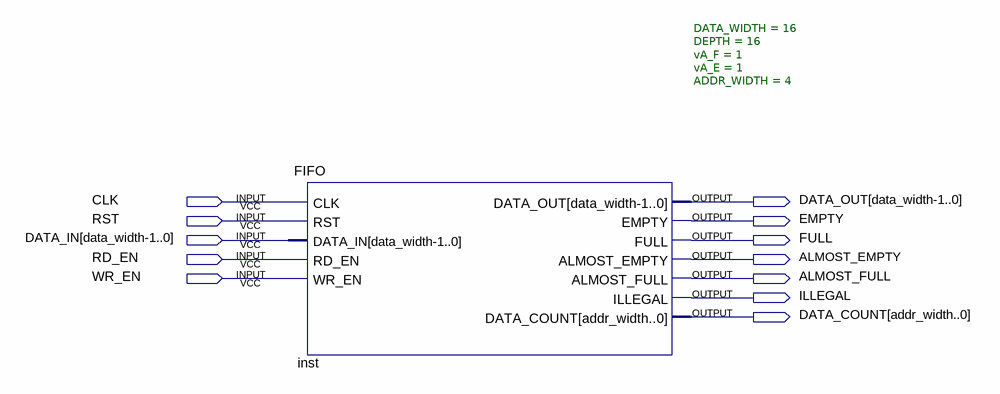
[diagram p0: schematic sheet]
// Quartus schematic ELEC241.bdf as structural Verilog: 1 symbols, 12 pins
module ELEC241 (
  input  CLK,
  input  RST,
  input  \DATA_IN[data_width-1..0] ,
  input  RD_EN,
  input  WR_EN,
  output \DATA_OUT[data_width-1..0] ,
  output EMPTY,
  output FULL,
  output ALMOST_EMPTY,
  output ALMOST_FULL,
  output ILLEGAL,
  output \DATA_COUNT[addr_width..0] 
);

  FIFO #(.DATA_WIDTH(16), .DEPTH(16), .vA_F(1), .vA_E(1), .ADDR_WIDTH(4)) inst (
    .CLK(CLK), .RST(RST), .DATA_IN({16{\DATA_IN[data_width-1..0] }}), .RD_EN(RD_EN), .WR_EN(WR_EN),
    .DATA_OUT(\DATA_OUT[data_width-1..0] ), .EMPTY(EMPTY), .FULL(FULL), .ALMOST_EMPTY(ALMOST_EMPTY),
    .ALMOST_FULL(ALMOST_FULL), .ILLEGAL(ILLEGAL), .DATA_COUNT(\DATA_COUNT[addr_width..0] ));
endmodule
